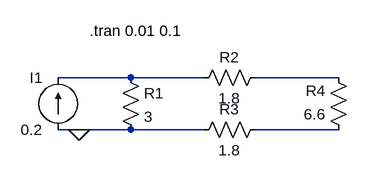
[diagram p0: schematic Draft31.asc]
Draft31.asc, the LTspice schematic file:
Version 4
SHEET 1 880 680
WIRE 224 272 112 272
WIRE 336 272 224 272
WIRE 544 272 416 272
WIRE 144 352 112 352
WIRE 224 352 144 352
WIRE 336 352 224 352
WIRE 544 352 416 352
FLAG 144 352 0
SYMBOL current 112 352 R180
WINDOW 0 24 80 Left 2
WINDOW 3 24 0 Left 2
SYMATTR InstName I1
SYMATTR Value 0.2
SYMBOL res 208 256 R0
SYMATTR InstName R1
SYMATTR Value 3
SYMBOL res 432 256 R90
WINDOW 0 0 56 VBottom 2
WINDOW 3 32 56 VTop 2
SYMATTR InstName R2
SYMATTR Value 1.8
SYMBOL res 432 336 R90
WINDOW 0 0 56 VBottom 2
WINDOW 3 32 56 VTop 2
SYMATTR InstName R3
SYMATTR Value 1.8
SYMBOL res 560 368 R180
WINDOW 0 36 76 Left 2
WINDOW 3 36 40 Left 2
SYMATTR InstName R4
SYMATTR Value 6.6
TEXT 160 200 Left 2 !.tran 0.01 0.1

The netlist it stands for:
* Draft31.asc
I1 0 N001 0.2
R1 N001 0 3
R2 N002 N001 1.8
R3 N003 0 1.8
R4 N003 N002 6.6
.tran 0.01 0.1
.backanno
.end